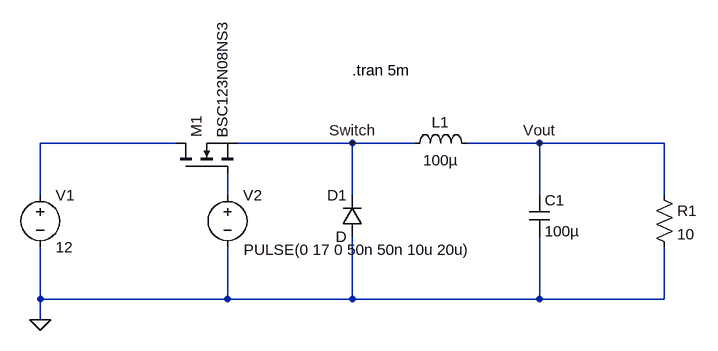
[diagram p0: schematic buck_converter.asc]
buck_converter.asc, the LTspice schematic file:
Version 4
SHEET 1 1204 680
WIRE 400 96 192 96
WIRE 672 96 496 96
WIRE 768 96 672 96
WIRE 960 96 848 96
WIRE 1152 96 960 96
WIRE 192 176 192 96
WIRE 480 176 480 144
WIRE 672 176 672 96
WIRE 960 176 960 96
WIRE 1152 176 1152 96
WIRE 192 336 192 256
WIRE 480 336 480 256
WIRE 480 336 192 336
WIRE 672 336 672 240
WIRE 672 336 480 336
WIRE 960 336 960 240
WIRE 960 336 672 336
WIRE 1152 336 1152 256
WIRE 1152 336 960 336
WIRE 192 368 192 336
FLAG 192 368 0
FLAG 672 96 Switch
FLAG 960 96 Vout
SYMBOL voltage 192 160 R0
SYMATTR InstName V1
SYMATTR Value 12
SYMBOL nmos 400 144 R270
SYMATTR InstName M1
SYMATTR Value BSC123N08NS3
SYMBOL diode 688 240 R180
WINDOW 0 24 64 Left 2
WINDOW 3 24 0 Left 2
SYMATTR InstName D1
SYMBOL ind 752 112 R270
WINDOW 0 32 56 VTop 2
WINDOW 3 5 56 VBottom 2
SYMATTR InstName L1
SYMATTR Value 100µ
SYMBOL cap 944 176 R0
SYMATTR InstName C1
SYMATTR Value 100µ
SYMBOL res 1136 160 R0
SYMATTR InstName R1
SYMATTR Value 10
SYMBOL voltage 480 160 R0
WINDOW 3 25 100 Left 2
SYMATTR Value PULSE(0 17 0 50n 50n 10u 20u)
SYMATTR InstName V2
TEXT 672 -16 Left 2 !.tran 5m

The netlist it stands for:
* buck_converter.asc
V1 N001 0 12
M1 N001 N002 Switch Switch BSC123N08NS3
D1 0 Switch D
L1 Switch Vout 100µ
C1 Vout 0 100µ
R1 Vout 0 10
V2 N002 0 PULSE(0 17 0 50n 50n 10u 20u)
.model D D
.lib standard.dio
.model NMOS NMOS
.model PMOS PMOS
.lib standard.mos
.tran 5m
.backanno
.end